# Altium schematic sheet HDMI.SchDoc
size A
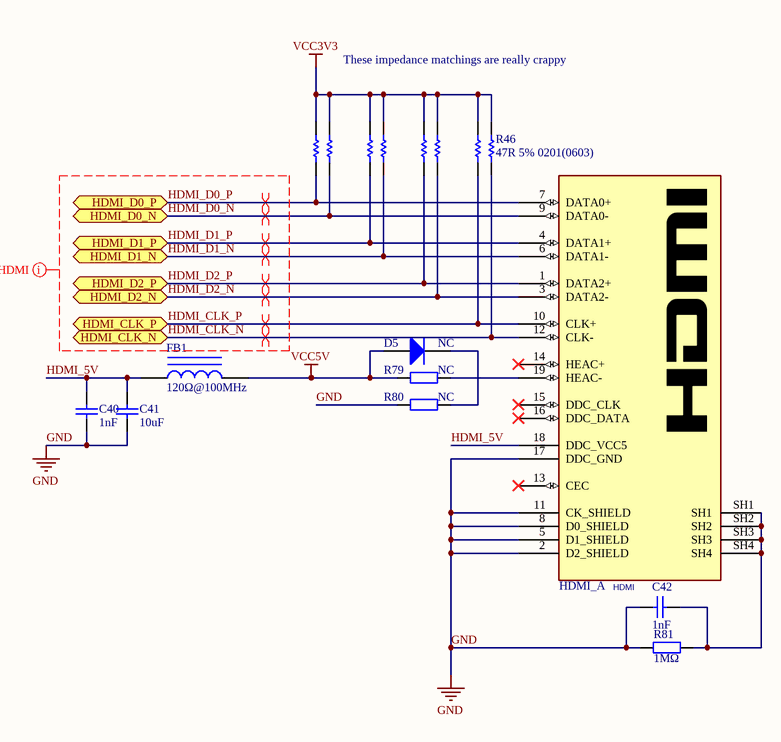
[diagram p0: HDMI.SchDoc]

## Parts
C40  1nF  [0805_C]
C41  10uF  [0603_C]
C42  1nF  [0805_C]
D5  NC  [SMA(DO-214AC)_S1]
FB1  120Ω@100MHz  [0805_L]
HDMI  HDMI_A  [HDMI_A]
R35  47R 5% 0201(0603)  [RESC0201(0603)_N]  (value not drawn)
R36  47R 5% 0201(0603)  [RESC0201(0603)_N]  (value not drawn)
R39  47R 5% 0201(0603)  [RESC0201(0603)_N]  (value not drawn)
R41  47R 5% 0201(0603)  [RESC0201(0603)_N]  (value not drawn)
R43  47R 5% 0201(0603)  [RESC0201(0603)_N]  (value not drawn)
R44  47R 5% 0201(0603)  [RESC0201(0603)_N]  (value not drawn)
R45  47R 5% 0201(0603)  [RESC0201(0603)_N]  (value not drawn)
R46  47R 5% 0201(0603)  [RESC0201(0603)_N]
R79  NC  [0805_R]
R80  NC  [0805_R]
R81  1MΩ  [0805_R]

## Ports
HDMI_CLK_N (bidir), HDMI_CLK_P (bidir), HDMI_D0_N (bidir), HDMI_D0_P (bidir), HDMI_D1_N (bidir), HDMI_D1_P (bidir), HDMI_D2_N (bidir), HDMI_D2_P (bidir)

## Nets
GND: C40.2 C41.1 C42.2 HDMI.2(D2_SHIELD) HDMI.5(D1_SHIELD) HDMI.8(D0_SHIELD) HDMI.11(CK_SHIELD) HDMI.17(DDC_GND) R80.2 R81.2
VCC3V3: R35.2 R36.2 R39.2 R41.2 R43.2 R44.2 R45.2 R46.2
VCC5V: D5.1(A) FB1.2 R79.2
HDMI_5V: C40.1 C41.2 FB1.1 HDMI.18(DDC_VCC5)
HDMI_CLK_N: HDMI.12(CLK-) R46.1 ; port HDMI_CLK_N
HDMI_CLK_P: HDMI.10(CLK+) R45.1 ; port HDMI_CLK_P
HDMI_D0_N: HDMI.9(DATA0-) R36.1 ; port HDMI_D0_N
HDMI_D0_P: HDMI.7(DATA0+) R35.1 ; port HDMI_D0_P
HDMI_D1_N: HDMI.6(DATA1-) R41.1 ; port HDMI_D1_N
HDMI_D1_P: HDMI.4(DATA1+) R39.1 ; port HDMI_D1_P
HDMI_D2_N: HDMI.3(DATA2-) R44.1 ; port HDMI_D2_N
HDMI_D2_P: HDMI.1(DATA2+) R43.1 ; port HDMI_D2_P
NetC42_1: C42.1 HDMI.SH1 HDMI.SH2 HDMI.SH3 HDMI.SH4 R81.1
NetD5_2: D5.2(K) R80.1
NetHDMI_19: HDMI.19(HEAC-) R79.1

Not connected (* = marked no-connect by the designer): HDMI 13(CEC)* 14(HEAC+)* 15(DDC_CLK)* 16(DDC_DATA)*

## Layout directives
differential pair: HDMI_CLK_N, HDMI_CLK_P, HDMI_D0_N, HDMI_D0_P, HDMI_D1_N, HDMI_D1_P, HDMI_D2_N, HDMI_D2_P
rule Impedance Constraint [Min = 50.00    Max = 50.00    ]; rule Length Constraint [Min Length = 1000mil    Max Length = 2000mil]; net class HDMI: HDMI_CLK_N, HDMI_CLK_P, HDMI_D0_N, HDMI_D0_P, HDMI_D1_N, HDMI_D1_P, HDMI_D2_N, HDMI_D2_P

## Notes on the sheet
- These impedance matchings are really crappy

## Library data of the parts
C40 C42 = 0805 1nF (102) 10% 50V: 贴片电容; ComponentLink1Description: 供应商链接; ComponentLink1URL: http://www.szlcsc.com/product/details_52223.html; Package: 0805; Supplier: LC; SuppliersPartNumber: C51210
C41 = 0603 10uF (106) 10% 10V: 贴片电容; ComponentLink1Description: 供应商链接; ComponentLink1URL: http://www.szlcsc.com/product/details_20411.html; Package: 0603; Supplier: LC; SuppliersPartNumber: C19702
D5 = SMA(DO-214AC) SS210: 二极管 TVS; ComponentLink1Description: 供应商链接; ComponentLink1URL: http://www.szlcsc.com/product/details_15669.html; Package: SMA(DO-214AC); Supplier: LC; SuppliersPartNumber: C14996
FB1 = 0805 600Ω 25% 100MHz: 贴片磁珠; ComponentLink1Description: 供应商链接; ComponentLink1URL: http://www.szlcsc.com/product/details_1369.html; Package: 0805; Supplier: LC; SuppliersPartNumber: C1017
HDMI = CONN_HDMI_A: CONN, HDMI, Receptacle, TYPE A, 19P, RIGH-ANGLE; MANF: Molex, WURTH; MANF_P#: 47151-0001, 500254-1927, 685119134923; PARAM: Receptacle, 19P, RIGH-ANGLE; PRICE: 2.57$; VALUE: HDMI_A
R35 R36 R39 R41 R43-R46 = CMP-1010-00042-1: 47R 0.05W 5% 0201 (0603 Metric)  SMD; Manufacturer: Yageo; Manufacturer Part Number: RC0201JR-0747RL; Value: 47.00 Ohm; Case-Metric: 0603; Case-EIA: 0201; Description: Res Thick Film 0201 47 Ohm 5% 1/20W ±200ppm/°C Molded SMD SMD Paper T/R; Voltage Rating: 25V; Temperature Coefficient: 200ppm/°C; Power Rating: 50mW; Power: 0.05 W; Tolerance: 5 %; Technology: SMT; Supplier 1: Future Electronics; Supplier Part Number 1: 5338678; RoHS: Yes; Category: Chip SMD Resistors; Stock 1: 200000; Pricing 1: 10000=0.0011, 50000=0.0011, 250000=0.001, 1000000=0.0009, 2500000=0.0009 (USD); Case/Package: 0201; Case Code (Imperial): 0201; Case Code (Metric): 0603; Contact Plating: Tin,Matte; Weight: 6E-06oz; Min Operating Temperature: -55°C; Max Operating Temperature: 125°C; Packaging: Cut Tape; Series: RC; Voltage Rating (DC): 25V; Termination: SMD/SMT; Resistance Tolerance: 5%; Resistor Type: Thick Film; Max Power Dissipation: 50mW; Number of Terminations: 2; Features: Moisture Resistant; Length: 0.6mm; Width: 0.3mm; Height: 0.23mm; RoHS Compliant: Yes; Reach SVHC Compliant: No; Lead Free: Lead Free; ComponentLink1URL: https://datasheet.ciiva.com/7672/1563626-7672293.pdf?src-supplier=Element14; ComponentLink1Description: https://datasheet.ciiva.com/7672/1563626-7672293.pdf?src-supplier=Element14; ComponentLink2URL: https://datasheet.ciiva.com/7672/1563626-7672294.pdf?src-supplier=Element14; ComponentLink2Description: https://datasheet.ciiva.com/7672/1563626-7672294.pdf?src-supplier=Element14; ComponentLink3URL: https://datasheet.ciiva.com/2522/pyu-r-int-thick-7-2522699.pdf?src-supplier=Digi-Key; ComponentLink3Description: https://datasheet.ciiva.com/2522/pyu-r-int-thick-7-2522699.pdf?src-supplier=Digi-Key; ComponentLink4URL: https://datasheet.ciiva.com/2522/pyu-r-int-thick-7-2522700.pdf?src-supplier=Digi-Key; ComponentLink4Description: https://datasheet.ciiva.com/2522/pyu-r-int-thick-7-2522700.pdf?src-supplier=Digi-Key; ComponentLink5URL: https://datasheet.ciiva.com/2522/pyu-r-int-thick-7-2522698.pdf?src-supplier=Digi-Key; ComponentLink5Description: https://datasheet.ciiva.com/2522/pyu-r-int-thick-7-2522698.pdf?src-supplier=Digi-Key; ComponentLink6URL: https://datasheet.ciiva.com/8889/pyu-rc0201-51-rohs-l-8-8889021.pdf?src-supplier=Avnet; ComponentLink6Description: https://datasheet.ciiva.com/8889/pyu-rc0201-51-rohs-l-8-8889021.pdf?src-supplier=Avnet
R79-R81 = 0805 1MΩ (1004) 1%: 贴片电阻; ComponentLink1Description: 供应商链接; ComponentLink1URL: http://www.szlcsc.com/product/details_18202.html; Package: 0805; Supplier: LC; SuppliersPartNumber: C17514